# Altium project HBN_Portable_Charger.PrjPcb
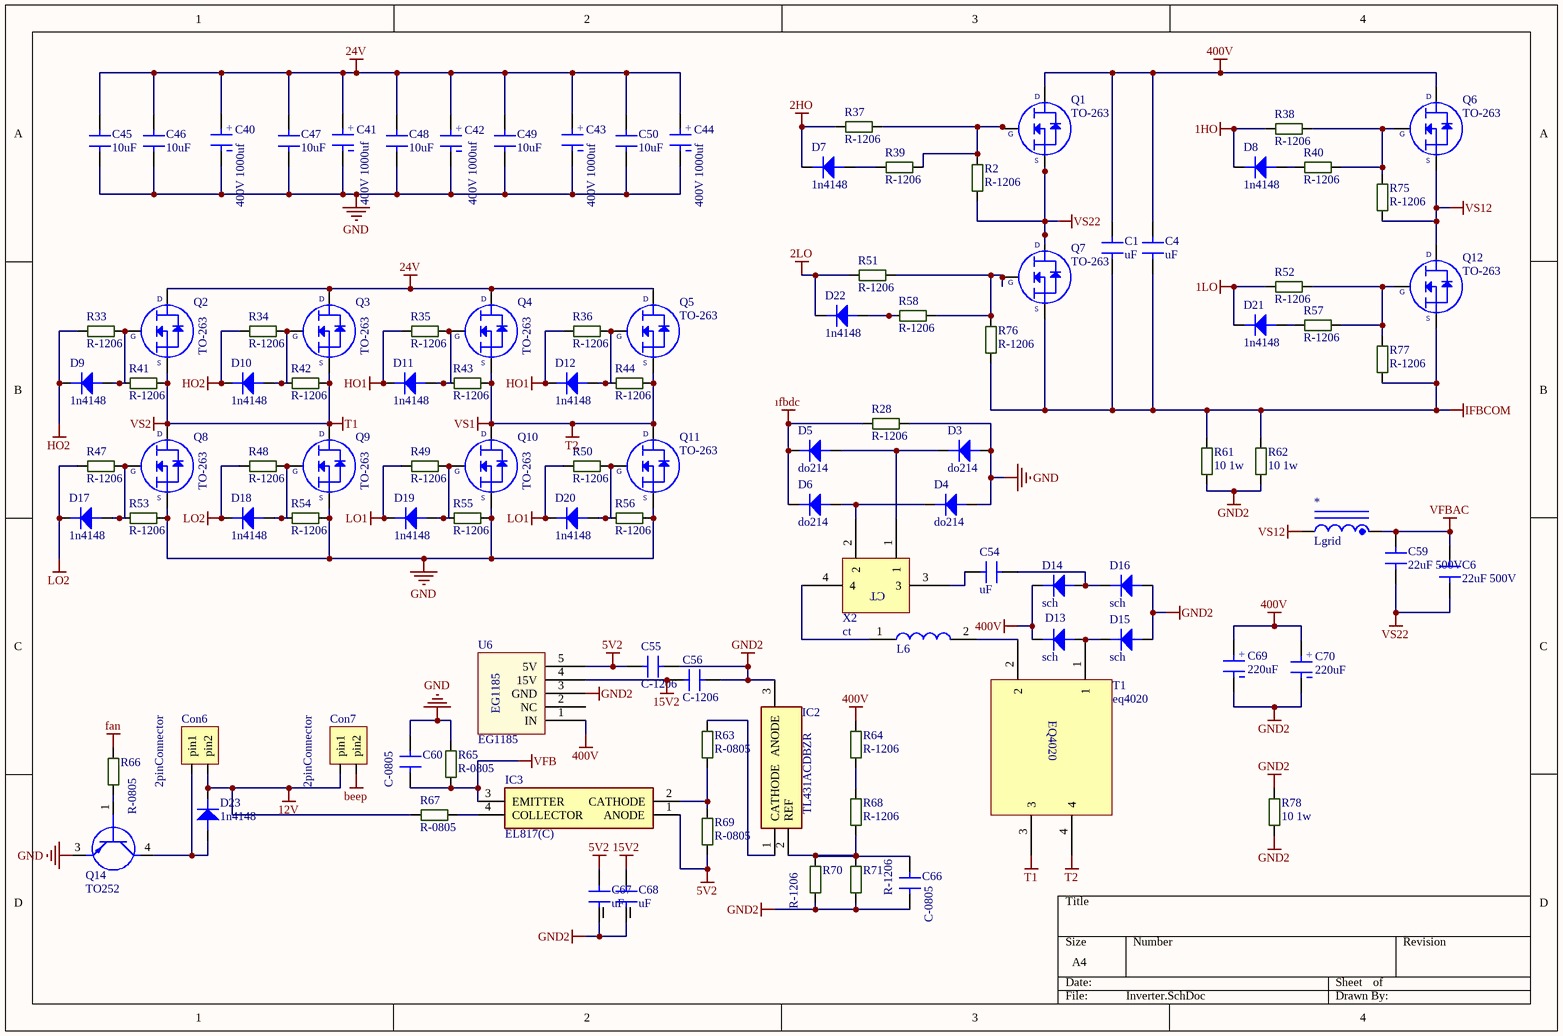
[diagram p0: Inverter.SchDoc]
4 sheets, 213 parts. Net scope: global (net labels, ports and power ports of the same name join across sheets).
Board file: Layout.PcbDoc
Sheets:
  Inverter.SchDoc
  Power Distrubition.SchDoc
  EGT003.SchDoc
  EG8010.SchDoc

## Sheet Inverter.SchDoc
size A4; SheetNumber: 1; SheetTotal: 4

### Parts
*  Lgrid  [Lgrid]
C1  uF  [680nF bulk]
C4  uF  [680nF bulk]
C6  22uF 500V  [CAP.POL 22UF 500VDC - duplicate]
C40  400V 1000uf  [CAP_EEETC1C331V]
C41  400V 1000uf  [CAP_EEETC1C331V]
C42  400V 1000uf  [CAP_EEETC1C331V]
C43  400V 1000uf  [CAP_EEETC1C331V]
C44  400V 1000uf  [CAP_EEETC1C331V]
C45  10uF  [C-2220R]
C46  10uF  [C-2220R]
C47  10uF  [C-2220R]
C48  10uF  [C-2220R]
C49  10uF  [C-2220R]
C50  10uF  [C-2220R]
C54  uF  [680nF bulk]
C55  C-1206  [C-1206W]
C56  C-1206  [C-1206W]
C59  22uF 500V  [CAP.POL 22UF 500VDC - duplicate]
C60  C-0805  [C-0805W]
C66  C-0805  [C-0805W]
C67  uF  [CapSmdElc]
C68  uF  [CapSmdElc]
C69  220uF  [Koshin]
C70  220uF  [Koshin]
Con6  2pinConnector  [2pinCon]
Con7  2pinConnector  [2pinCon]
D3  do214  [DO-214AC]
D4  do214  [DO-214AC]
D5  do214  [DO-214AC]
D6  do214  [DO-214AC]
D7  1n4148  [SOD123]
D8  1n4148  [SOD123]
D9  1n4148  [SOD123]
D10  1n4148  [SOD123]
D11  1n4148  [SOD123]
D12  1n4148  [SOD123]
D13  sch  [DPAK_TO263 - sch]
D14  sch  [DPAK_TO263 - sch]
D15  sch  [DPAK_TO263 - sch]
D16  sch  [DPAK_TO263 - sch]
D17  1n4148  [SOD123]
D18  1n4148  [SOD123]
D19  1n4148  [SOD123]
D20  1n4148  [SOD123]
D21  1n4148  [SOD123]
D22  1n4148  [SOD123]
D23  1n4148  [SOD123]
IC2  TL431ACDBZR  [SOT95P237X112-3N]
IC3  EL817(C)  [DIP762W60P254L458H480Q4N]
L6  inducter_SMPI06050  [inductor]  (value not drawn)
Q1  TO-263  [DPAK_TO263]
Q2  TO-263  [DPAK_TO263]
Q3  TO-263  [DPAK_TO263]
Q4  TO-263  [DPAK_TO263]
Q5  TO-263  [DPAK_TO263]
Q6  TO-263  [DPAK_TO263]
Q7  TO-263  [DPAK_TO263]
Q8  TO-263  [DPAK_TO263]
Q9  TO-263  [DPAK_TO263]
Q10  TO-263  [DPAK_TO263]
Q11  TO-263  [DPAK_TO263]
Q12  TO-263  [DPAK_TO263]
Q14  TO252  [D-PAK_TO252AA]
R2  R-1206  [R-1206W]
R28  R-1206  [R-1206W]
R33  R-1206  [R-1206W]
R34  R-1206  [R-1206W]
R35  R-1206  [R-1206W]
R36  R-1206  [R-1206W]
R37  R-1206  [R-1206W]
R38  R-1206  [R-1206W]
R39  R-1206  [R-1206W]
R40  R-1206  [R-1206W]
R41  R-1206  [R-1206W]
R42  R-1206  [R-1206W]
R43  R-1206  [R-1206W]
R44  R-1206  [R-1206W]
R47  R-1206  [R-1206W]
R48  R-1206  [R-1206W]
R49  R-1206  [R-1206W]
R50  R-1206  [R-1206W]
R51  R-1206  [R-1206W]
R52  R-1206  [R-1206W]
R53  R-1206  [R-1206W]
R54  R-1206  [R-1206W]
R55  R-1206  [R-1206W]
R56  R-1206  [R-1206W]
R57  R-1206  [R-1206W]
R58  R-1206  [R-1206W]
R61  10 1w  [R-2512W]
R62  10 1w  [R-2512W]
R63  R-0805  [R-0805W]
R64  R-1206  [R-1206W]
R65  R-0805  [R-0805W]
R66  R-0805  [R-0805W]
R67  R-0805  [R-0805W]
R68  R-1206  [R-1206W]
R69  R-0805  [R-0805W]
R70  R-1206  [R-1206W]
R71  R-1206  [R-1206W]
R75  R-1206  [R-1206W]
R76  R-1206  [R-1206W]
R77  R-1206  [R-1206W]
R78  10 1w  [R-2512W]
T1  eq4020  [eq4020]
U6  EG1185  [EG1185]
X2  ct  [ct]

### Nets
1HO: D8.k R38.1
1LO: D21.k R52.1
2HO: D7.k R37.1
2LO: D22.k R51.1
5V2: C55.1 C67.1 IC3.1(ANODE) R69.1 U6.5(5V)
12V: Con6.2(pin2) Con7.1(pin1) D23.k R67.1
15V2: C56.1 C68.1 U6.4(15V)
24V: C40.1 C41.1 C42.1 C43.1 C44.1 C45.1 C46.1 C47.1 C48.1 C49.1 C50.1 Q2.3 Q3.3 Q4.3 Q5.3
400V: C1.2 C4.2 C69.2 C70.2 D13.1 D14.1 Q1.3 Q6.3 R64.2 U6.1(IN)
beep: Con7.2(pin2)
fan: R66.1
GND: C40.2 C41.2 C42.2 C43.2 C44.2 C45.2 C46.2 C47.2 C48.2 C49.2 C50.2 C60.2 D3.a D4.a Q8.2 Q9.2 Q10.2 Q11.2 Q14.3(E) R28.2 R53.2 R54.2 R55.2 R56.2 R65.2
GND2: C55.2 C56.2 C66.1 C67.2 C68.2 C69.1 C70.1 D15.2 D16.2 IC2.3(ANODE) R61.1 R62.1 R70.1 R71.1 R78.1 R78.2 U6.3(GND)
HO1: D11.k D12.k R35.1 R36.1
HO2: D9.k D10.k R33.1 R34.1
IFBCOM: C1.1 C4.1 Q7.2 Q12.2 R61.2 R62.2 R76.1 R77.2
LO1: D19.k D20.k R49.1 R50.1
LO2: D17.k D18.k R47.1 R48.1
T1: Q2.2 Q3.2 Q8.3 Q9.3 R41.2 R42.2 T1.3  [also labelled VS2]
T2: Q4.2 Q5.2 Q10.3 Q11.3 R43.2 R44.2 T1.4  [also labelled VS1]
VFB: C60.1 IC3.3(EMITTER) R65.1
VFBAC: *.1 C6.2 C59.2
VS12: *.2 Q6.2 Q12.3 R75.2
VS22: C6.1 C59.1 Q1.2 Q7.3 R2.1
ıfbdc: D5.k D6.k R28.1
NetC54_1: C54.1 X2.3
NetC54_2: C54.2 D14.2 D16.1
NetC66_2: C66.2 IC2.2(REF) R68.1 R70.2 R71.2
NetCon6_1: Con6.1(pin1) D23.a Q14.4(C)
NetD3_k: D3.k D5.a X2.1
NetD4_k: D4.k D6.a X2.2
NetD7_a: D7.a R39.1
NetD8_a: D8.a R40.1
NetD9_a: D9.a Q2.1 R33.2 R41.1
NetD10_a: D10.a Q3.1 R34.2 R42.1
NetD11_a: D11.a Q4.1 R35.2 R43.1
NetD12_a: D12.a Q5.1 R36.2 R44.1
NetD13_2: D13.2 D15.1 T1.1
NetD17_a: D17.a Q8.1 R47.2 R53.1
NetD18_a: D18.a Q9.1 R48.2 R54.1
NetD19_a: D19.a Q10.1 R49.2 R55.1
NetD20_a: D20.a Q11.1 R50.2 R56.1
NetD21_a: D21.a R57.1
NetD22_a: D22.a R58.1
NetIC2_1: IC2.1(CATHODE) R63.1
NetIC3_2: IC3.2(CATHODE) R63.2 R69.2
NetIC3_4: IC3.4(COLLECTOR) R67.2
NetL6_1: L6.1 X2.4
NetL6_2: L6.2 T1.2
NetQ1_1: Q1.1 R2.2 R37.2 R39.2
NetQ6_1: Q6.1 R38.2 R40.2 R75.1
NetQ7_1: Q7.1 R51.2 R58.2 R76.2
NetQ12_1: Q12.1 R52.2 R57.2 R77.1
NetQ14_1: Q14.1(B) R66.2
NetR64_1: R64.1 R68.2

Not connected (* = marked no-connect by the designer): U6 2(NC)

### Notes on the sheet
- (in symbol Aluminum Electrolytic Capacitors) +
- (in symbol CAP.EL.220uF 500V) +
- (in symbol ct) CT
- (in symbol eq4020) EQ4020
- (in symbol TO-263_1) D; G; S

### Library data of the parts
C1 C4 C54 = 680
C6 C59 = CAP.POL 22UF 500VDC: ComponentLink1Description: https://www.ozdisan.com/pasif-komponentler/kondansatorler/film-kondansatorler/C3D2H226JB00C00; ComponentLink1URL: https://www.ozdisan.com/pasif-komponentler/kondansatorler/film-kondansatorler/C3D2H226JB00C00
C40-C44 = Aluminum Electrolytic Capacitors: Manufacturer: Nichicon; Manufacturer Part Number: LKS1J472MESZ; Capacitance: 4.7mF; Voltage Rating: 63V; Tolerance: 20%; Ripple Current: 3A; Life (Hours): 1000Hour; Supplier 1: Mouser; RoHS: Yes; Mount: Through Hole; Case/Package: Radial; Min Operating Temperature: -40°C; Max Operating Temperature: 85°C; Package Quantity: 250; Packaging: Bulk; Voltage Rating (DC): 63V; Termination: Snap in; Diameter: 22mm; Length: 45mm; Lead Pitch: 0.394inch; Height - Seated (Max): 1.772inch; Supplier Part Number 1: 647-LKS1J472MESZ; ComponentLink2Description: https://www.ozdisan.com/pasif-komponentler/kondansatorler/aluminyum-kondansatorler/PKL5-063V472MM450; ComponentLink2URL: https://www.ozdisan.com/pasif-komponentler/kondansatorler/aluminyum-kondansatorler/PKL5-063V472MM450
C45-C50 = Cap2220: 2220; Özdisan Part Number: CL31B475KBHNNNE; Manufacturer: SAMSUNG; Link: https://www.ozdisan.com/pasif-komponentler/kondansatorler/smd-kondansatorler-mlcc/CL31B475KBHNNNE; Price: 0,10407
C67 C68 = CAPSMDELC
C69 C70 = CAP.EL.220uF 500V: ComponentLink1Description: https://www.ozdisan.com/pasif-komponentler/kondansatorler/aluminyum-kondansatorler/K055002210PM0E040; ComponentLink1URL: https://www.ozdisan.com/pasif-komponentler/kondansatorler/aluminyum-kondansatorler/K055002210PM0E040
D3-D6 = do214: DIODE FAST SWITCHING Single 150mA 75V SMT SOD323
D7-D12 D17-D23 = 1N4148W-E3-18: Diode Small Signal Switching 100V 0.15A 2-Pin SOD-123 T/R; Manufacturer: Vishay; Recovery Time: 4ns; Max Power Dissipation: 350mW; Forward Current: 150mA; Max Surge Current: 2A; Forward Voltage: 1.2V; Max Reverse Leakage Current: 5uA; Element Configuration: Single; Max Reverse Voltage (DC): 75V; Peak Reverse Current: 100uA; Supplier 1: Allied Electronics; Manufacturer Part Number: 1N4148W-E3-18; RoHS: Yes; Stock 1: 6838; Pricing 1: 1 = 0.03900, 25 = 0.03800, 100 = 0.03600, 250 = 0.03400, 500 = 0.03200, 1000 = 0.03100, 2500 = 0.02900 (USD); Mount: Surface Mount; Number of Pins: 2; Weight: 0.000363oz; Contact Plating: Tin; Min Operating Temperature: -55°C; Max Operating Temperature: 150°C; Packaging: Tape and Reel; Package Quantity: 10000; Average Rectified Current: 150mA; Reverse Recovery Time: 4ns; Power Dissipation: 350mW; Max Repetitive Reverse Voltage (Vrrm): 100V; Peak Non-Repetitive Surge Current: 2A; Length: 2.85mm; Height: 1.25mm; Width: 1.7mm; Radiation Hardening: No; Lead Free: Lead Free; ComponentLink1URL: https://datasheet.ciiva.com/29885/1n4148w-29885941.pdf?src-supplier=Avnet; ComponentLink1Description: https://datasheet.ciiva.com/29885/1n4148w-29885941.pdf?src-supplier=Avnet; ComponentLink2URL: https://datasheet.ciiva.com/29593/1n4148w-29593113.pdf?src-supplier=Digi-Key; ComponentLink2Description: https://datasheet.ciiva.com/29593/1n4148w-29593113.pdf?src-supplier=Digi-Key; ComponentLink3URL: https://datasheet.ciiva.com/29593/1n4148w-29593111.pdf?src-supplier=Digi-Key; ComponentLink3Description: https://datasheet.ciiva.com/29593/1n4148w-29593111.pdf?src-supplier=Digi-Key; ComponentLink4URL: https://datasheet.ciiva.com/29593/1n4148w-29593112.pdf?src-supplier=Digi-Key; ComponentLink4Description: https://datasheet.ciiva.com/29593/1n4148w-29593112.pdf?src-supplier=Digi-Key; Supplier Part Number 1: 70061597
D13-D16 = sch: DIODE FAST SWITCHING Single 150mA 75V SMT SOD323
IC2 = TL431ACDBZR: Integrated Circuit; Manufacturer_Name: Texas Instruments; Datasheet Link: https://datasheet.datasheetarchive.com/originals/distributors/SFDatasheet-6/sf-000131849.pdf; Manufacturer_Part_Number: TL431ACDBZR; Mouser Part Number: 595-TL431ACDBZR; Mouser Price/Stock: https://www.mouser.co.uk/ProductDetail/Texas-Instruments/TL431ACDBZR?qs=odmYgEirbwzMcBuFx%2Fo8hQ%3D%3D; Arrow Part Number: TL431ACDBZR; Arrow Price/Stock: https://www.arrow.com/en/products/tl431acdbzr/texas-instruments?region=nac
IC3 = EL817(C): Integrated Circuit; Manufacturer_Name: Everlight; Datasheet Link: https://componentsearchengine.com/Datasheets/1/EL817(C).pdf; Height: 4.8mm; Manufacturer_Part_Number: EL817(C); Mouser Part Number: 638-EL817C; Mouser Price/Stock: https://www.mouser.com/Search/Refine.aspx?Keyword=638-EL817C
Q1-Q12 = TO-263_1
R61 R62 R78 = R-2512

## Sheet Power Distrubition.SchDoc
size A4; SheetNumber: 2; SheetTotal: 4
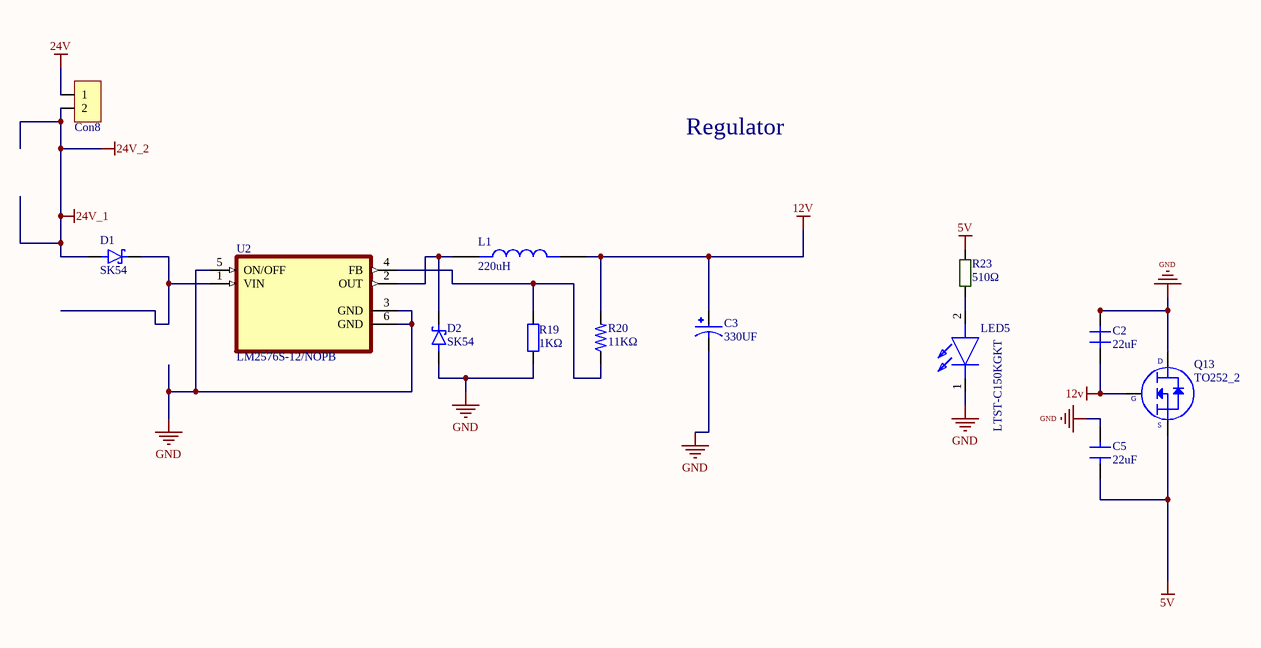
[diagram p1: Power Distrubition.SchDoc]

### Parts
C2  22uF  [C-0805]
C3  330UF  [CAP_EEETC1C331V]
C5  22uF  [C-0805]
Con8  Connector2_1  [Conn]  (value not drawn)
D1  SK54  [DIOM7959X265N]
D2  SK54  [DIOM7959X265N]
L1  220uH  [IND_MDH12577C-101MA=P3]
LED5  LTST-C150KGKT  [LED1206]
Q13  TO252_2  [TO-252]
R19  Deger: 1KΩ  [R-0805]  (hidden comment: RES SMD 1K OHM 1% 1/8W 0805)
R20  11KΩ  [R-0805]
R23  510Ω  [R-0603R]
U2  LM2576S-12/NOPB  [VREG_TPS79625KTTR]

### Nets
5V: C5.1 Q13.3 R23.2
12V: C2.1 C3.1 L1.2 Q13.1 R20.2
24V: Con8.1
24V_1: Con8.2 D1.A  [also labelled 24V_2]
GND: C2.2 C3.2 C5.2 D2.A LED5.1(K) Q13.4 R19.1 U2.3(GND) U2.5(ON/OFF) U2.6(GND)
NetD1_C: D1.C(K) U2.1(VIN)
NetD2_C: D2.C(K) L1.1 U2.2(OUT)
NetLED5_2: LED5.2(A) R23.1
NetR19_2: R19.2 R20.1 U2.4(FB)

### Notes on the sheet
- Regulator
- (in symbol TO252_2) D; G; S

### Library data of the parts
C2 C5 = C-0805
C3 = CAP 330UF SMD: CAP ALUM 330UF 20% 16V SMD; MP: EEE-TC1C331V; MF: Panasonic Electronic Components; Value: *; Package: RADIAL-2 Panasonic; Availability: In Stock; SnapEDA_Link: https://www.snapeda.com/parts/EEE-TC1C331V/Panasonic/view-part/6178283/?ref=snap; Price: None; Purchase-URL: https://pricing.snapeda.com/search/part/EEE-TC1C331V/?ref=eda; Check_prices: https://www.snapeda.com/parts/EEE-TC1C331V/Panasonic/view-part/6178283/?ref=eda
D1 D2 = SK54: Diode Schottky 40V 5A Surface Mount DO-214AA (SMB); MP: MBRS320T3G; MF: ON Semiconductor; Package: DO-214 ON Semiconductor; Availability: Good; Arrow_Electronics-Purchase-URL: https://snapeda.com/shop?store=Arrow+Electronics&id=432205; SnapEDA_Link: https://www.snapeda.com/parts/MBRS320T3G/ON%20Semiconductor/view-part/432205/?ref=snap; DigiKey-Purchase-URL: https://snapeda.com/shop?store=DigiKey&id=432205; Mouser-Purchase-URL: https://snapeda.com/shop?store=Mouser&id=432205; Value: *; Price: None
L1 = 220uH Inductor SMD: Inductor Power Shielded Wirewound 220uH 20% 100KHz Ferrite 1.1A 0.325Ohm DCR 5049 Automotive T/R; MP: MDH12577C-101MA=P3; Package: None; Price: None; Value: *; Availability: Unavailable
LED5 = LTST-C150KGKT: LED; Manufacturer_Name: Lite-On; Datasheet Link: http://optoelectronics.liteon.com/upload/download/ds22-2000-072/ltst-c150kgkt.pdf; Height: 1.2mm; Manufacturer_Part_Number: LTST-C150KGKT; Mouser Part Number: 859-LTST-C150KGKT; Mouser Price/Stock: https://www.mouser.com/Search/Refine.aspx?Keyword=859-LTST-C150KGKT; RS Part Number: 6920871; RS Price/Stock: https://uk.rs-online.com/web/p/products/6920871
Q13 = TO252_2: Manufacturer: Infineon; Manufacturer Part Number: IRF3205STRLPBF; Drain to Source Voltage (Vdss): 55V; Continuous Drain Current (ID): 110A; Rds On Max: 8mR; Input Capacitance: 3.247nF; Max Power Dissipation: 200W; Turn-Off Delay Time: 50ns; Turn-On Delay Time: 14ns; Gate to Source Voltage (Vgs): 20V; Threshold Voltage: 4V; Supplier 1: Digi-Key; RoHS: Yes; Stock 1: 3281; Pricing 1: 1 = 1,84000, 10 = 1,66600, 100 = 1,33840 (USD); Mount: Surface Mount; Case/Package: D2PAK; Number of Pins: 3; Min Operating Temperature: -55°C; Max Operating Temperature: 175°C; Packaging: Cut Tape; Power Dissipation: 200W; Drain to Source Resistance: 8mR; Drain to Source Breakdown Voltage: 55V; Length: 0.42inch; Height: 0.19inch; Width: 0.38inch; REACH SVHC: No SVHC; Lead Free: Lead Free; ComponentLink1URL: https://www.alliedelec.com/m/d/b8827ca43655240244f0cc5c2198e6b1.pdf?src-supplier=Allied+Electronics; ComponentLink1Description: https://www.alliedelec.com/m/d/b8827ca43655240244f0cc5c2198e6b1.pdf?src-supplier=Allied+Electronics; ComponentLink2URL: https://www.infineon.com/dgdl/irf3205spbf.pdf?fileId=5546d462533600a4015355defac9190c&src-supplier=Digi-Key; ComponentLink2Description: https://www.infineon.com/dgdl/irf3205spbf.pdf?fileId=5546d462533600a4015355defac9190c&src-supplier=Digi-Key; ComponentLink3URL: http://www.infineon.com/dgdl/irf3205spbf.pdf?fileId=5546d462533600a4015355defac9190c&src-supplier=Digi-Key; ComponentLink3Description: http://www.infineon.com/dgdl/irf3205spbf.pdf?fileId=5546d462533600a4015355defac9190c&src-supplier=Digi-Key; ComponentLink4URL: http://www.farnell.com/datasheets/1884183.pdf?src-supplier=Element14; ComponentLink4Description: http://www.farnell.com/datasheets/1884183.pdf?src-supplier=Element14; Supplier Part Number 1: IRF3205STRLPBFCT-ND
R19 = 1K 0805: 1 kOhms ±1% 0.125W, 1/8W Chip Resistor 0805 (2012 Metric) Moisture Resistant Thick Film; Cins: Direnc; Uretici Kodu: RC0805FR-071KL; Kılıf: 0805; -Sicaklik: -55; +Sicaklik: +155; Lehim Yöntemi: SMD; MSL: 1 (Unlimited)
R20 = RES 11KΩ SMD: THICK FILM RESISTOR, 11KOHM, 125mW, 5%; MP: CRCW080511K0JNEA; Package: None; Price: None; Value: *; Availability: Unavailable
R23 = R-0603
U2 = LM2576S-12/NOPB: SIMPLE SWITCHER&reg; 40V, 3A Low Component Count Step-Down Regulator 5-DDPAK/TO-263 -40 to 125; MF: Texas Instruments; Availability: Warning; SnapEDA_Link: https://www.snapeda.com/parts/LM2576S-12/NOPB/Texas%20Instruments/view-part/470772/?ref=snap; Mouser-Purchase-URL: https://snapeda.com/shop?store=Mouser&id=470772; Texas_Instruments-Purchase-URL: https://snapeda.com/shop?store=Texas+Instruments&id=470772; Value: *; Price: None; Package: TO-263-5 Texas Instruments; DigiKey-Purchase-URL: https://snapeda.com/shop?store=DigiKey&id=470772; MP: LM2576S-12/NOPB; BuyPart: https://www.snapeda.com/parts/LM2576S-12/NOPB/Texas%20Instruments/view-part/470772/?ref=eda
Con8 = Connector2_1: System: Connector

## Sheet EGT003.SchDoc
size A4; SheetNumber: 3; SheetTotal: 4
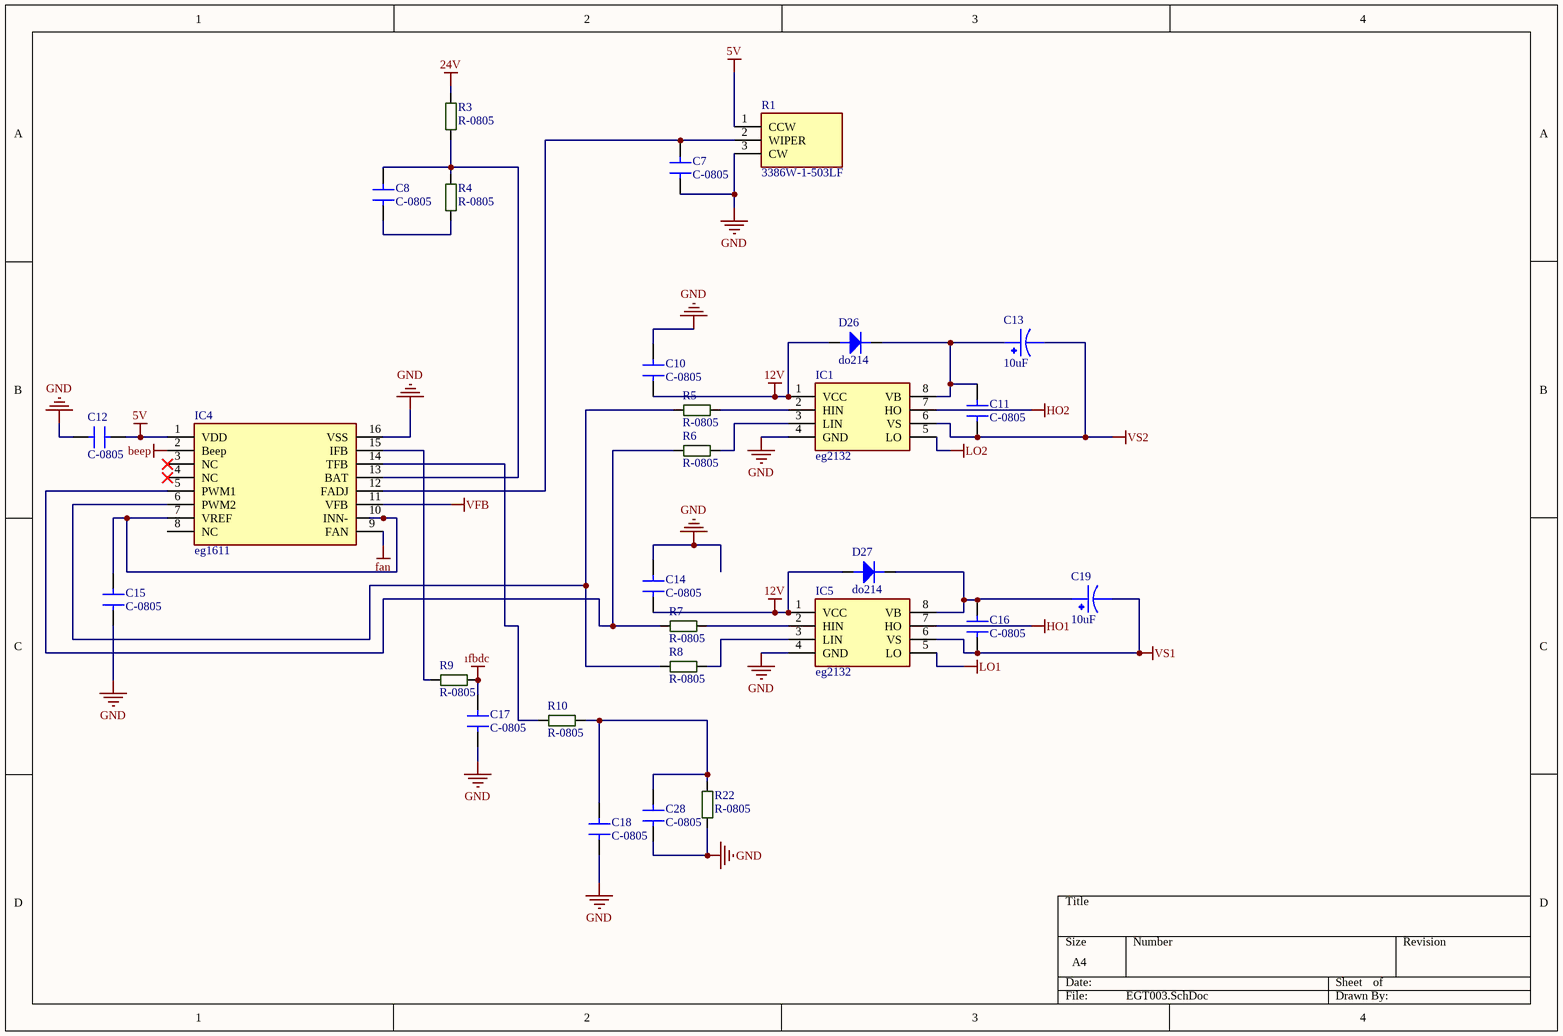
[diagram p2: EGT003.SchDoc]

### Parts
C7  C-0805  [C-0805W]
C8  C-0805  [C-0805W]
C10  C-0805  [C-0805W]
C11  C-0805  [C-0805W]
C12  C-0805  [C-0805W]
C13  10uF  [CapSmdElc]
C14  C-0805  [C-0805W]
C15  C-0805  [C-0805W]
C16  C-0805  [C-0805W]
C17  C-0805  [C-0805W]
C18  C-0805  [C-0805W]
C19  10uF  [CapSmdElc]
C28  C-0805  [C-0805W]
D26  do214  [DO-214AC]
D27  do214  [DO-214AC]
IC1  eg2132  [SOIC127P600X175-8N]
IC4  eg1611  [SOIC127P600X175-16N]
IC5  eg2132  [SOIC127P600X175-8N]
R1  3386W-1-503LF  [3386W]
R3  R-0805  [R-0805W]
R4  R-0805  [R-0805W]
R5  R-0805  [R-0805W]
R6  R-0805  [R-0805W]
R7  R-0805  [R-0805W]
R8  R-0805  [R-0805W]
R9  R-0805  [R-0805W]
R10  R-0805  [R-0805W]
R22  R-0805  [R-0805W]

### Nets
5V: C12.2 IC4.1(VDD) R1.1(CCW)
12V: C10.1 C14.1 D26.a D27.a IC1.1(VCC) IC5.1(VCC)
24V: R3.2
beep: IC4.2(Beep)
fan: IC4.9(FAN)
GND: C7.1 C10.2 C12.1 C14.2 C15.1 C17.1 C18.1 C28.1 IC1.4(GND) IC4.16(VSS) IC5.4(GND) R1.3(CW) R22.1
HO1: IC5.7(HO)
HO2: IC1.7(HO)
LO1: IC5.5(LO)
LO2: IC1.5(LO)
VFB: IC4.11(VFB)
VS1: C16.1 C19.2 IC5.6(VS)  [project net T2]
VS2: C11.1 C13.2 IC1.6(VS)  [project net T1]
ıfbdc: C17.2 R9.1
NetC7_2: C7.2 IC4.12(FADJ) R1.2(WIPER)
NetC8_1: C8.1 R4.1
NetC8_2: C8.2 IC4.13(BAT) R3.1 R4.2
NetC11_2: C11.2 C13.1 D26.k IC1.8(VB)
NetC15_2: C15.2 IC4.7(VREF) IC4.10(INN-)
NetC16_2: C16.2 C19.1 D27.k IC5.8(VB)
NetC18_2: C18.2 C28.2 R10.1 R22.2
NetIC1_2: IC1.2(HIN) R5.1
NetIC1_3: IC1.3(LIN) R6.1
NetIC4_5: IC4.5(PWM1) R6.2 R7.2
NetIC4_6: IC4.6(PWM2) R5.2 R8.2
NetIC4_14: IC4.14(TFB) R10.2
NetIC4_15: IC4.15(IFB) R9.2
NetIC5_2: IC5.2(HIN) R7.1
NetIC5_3: IC5.3(LIN) R8.1

Not connected (* = marked no-connect by the designer): IC4 3(NC)* 4(NC)* 8(NC)

### Library data of the parts
C13 C19 = 100 uF Electr Cap
D26 D27 = do214: as D3 on sheet Inverter
IC1 IC5 = eg2132: Integrated Circuit; Manufacturer_Name: Texas Instruments; Manufacturer_Part_Number: LM393ADR; Datasheet Link: http://www.ti.com/lit/ds/symlink/lm393a.pdf; Height: 1.75mm; Mouser Part Number: 595-LM393ADR; Mouser Price/Stock: https://www.mouser.co.uk/ProductDetail/Texas-Instruments/LM393ADR?qs=VolsR0DjNPq76ZV6Dhd8nQ%3D%3D; Arrow Part Number: LM393ADR; Arrow Price/Stock: https://www.arrow.com/en/products/lm393adr/texas-instruments
IC4 = eg1611: Integrated Circuit; Manufacturer_Name: STMicroelectronics; Manufacturer_Part_Number: HCF4538M013TR; Datasheet Link: http://www.st.com/resource/en/datasheet/cd00000410.pdf; Height: 1.75mm; Mouser Part Number: 511-4538BM-TR; Mouser Price/Stock: https://www.mouser.com/Search/Refine.aspx?Keyword=511-4538BM-TR
R1 = 3386W-1-503LF: Resistor; Manufacturer_Name: Bourns; Datasheet Link: http://www.bourns.com/docs/Product-Datasheets/3386.pdf; Manufacturer_Part_Number: 3386W-1-503LF; Mouser Part Number: 652-3386W-1-503LF; Mouser Price/Stock: https://www.mouser.co.uk/ProductDetail/Bourns/3386W-1-503LF?qs=aZhnFHiXcUS20GqScAFfrw%3D%3D; Arrow Part Number: 3386W-1-503LF; Arrow Price/Stock: https://www.arrow.com/en/products/3386w-1-503lf/bourns

## Sheet EG8010.SchDoc
size A4; SheetNumber: 4; SheetTotal: 4
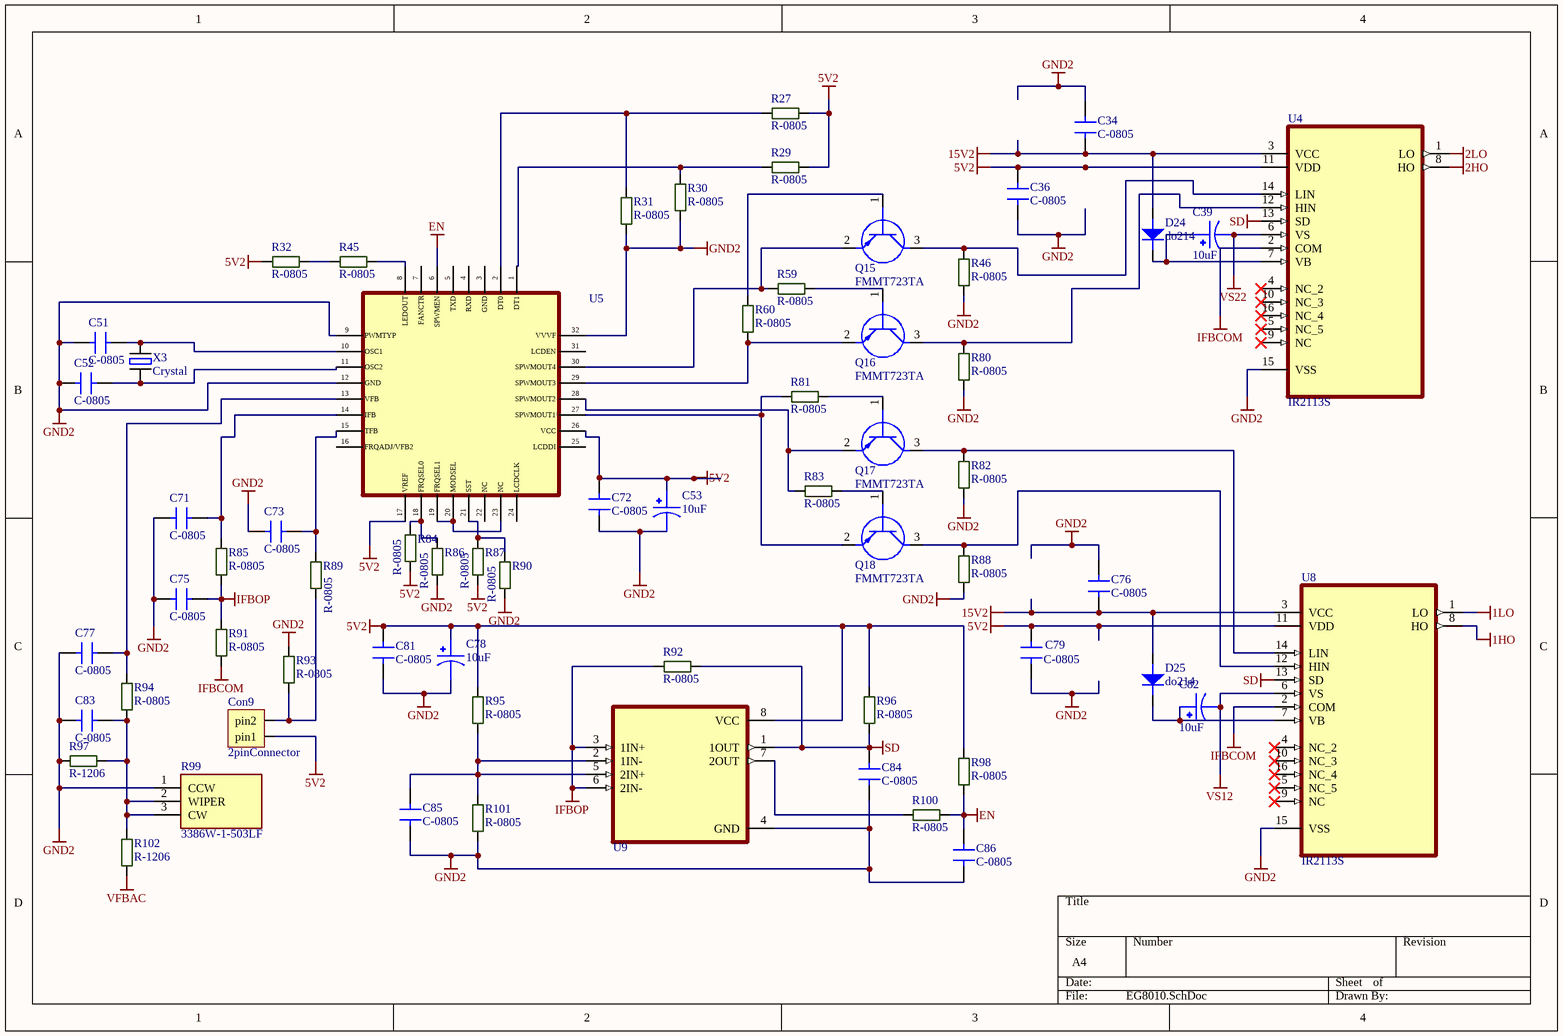
[diagram p3: EG8010.SchDoc]

### Parts
C34  C-0805  [C-0805W]
C36  C-0805  [C-0805W]
C39  10uF  [CapSmdElc]
C51  C-0805  [C-0805W]
C52  C-0805  [C-0805W]
C53  10uF  [CapSmdElc]
C71  C-0805  [C-0805W]
C72  C-0805  [C-0805W]
C73  C-0805  [C-0805W]
C75  C-0805  [C-0805W]
C76  C-0805  [C-0805W]
C77  C-0805  [C-0805W]
C78  10uF  [CapSmdElc]
C79  C-0805  [C-0805W]
C81  C-0805  [C-0805W]
C82  10uF  [CapSmdElc]
C83  C-0805  [C-0805W]
C84  C-0805  [C-0805W]
C85  C-0805  [C-0805W]
C86  C-0805  [C-0805W]
Con9  2pinConnector  [2pinCon]
D24  do214  [DO-214AC]
D25  do214  [DO-214AC]
Q15  FMMT723TA  [SOT96P240X100-3N]
Q16  FMMT723TA  [SOT96P240X100-3N]
Q17  FMMT723TA  [SOT96P240X100-3N]
Q18  FMMT723TA  [SOT96P240X100-3N]
R27  R-0805  [R-0805W]
R29  R-0805  [R-0805W]
R30  R-0805  [R-0805W]
R31  R-0805  [R-0805W]
R32  R-0805  [R-0805W]
R45  R-0805  [R-0805W]
R46  R-0805  [R-0805W]
R59  R-0805  [R-0805W]
R60  R-0805  [R-0805W]
R80  R-0805  [R-0805W]
R81  R-0805  [R-0805W]
R82  R-0805  [R-0805W]
R83  R-0805  [R-0805W]
R84  R-0805  [R-0805W]
R85  R-0805  [R-0805W]
R86  R-0805  [R-0805W]
R87  R-0805  [R-0805W]
R88  R-0805  [R-0805W]
R89  R-0805  [R-0805W]
R90  R-0805  [R-0805W]
R91  R-0805  [R-0805W]
R92  R-0805  [R-0805W]
R93  R-0805  [R-0805W]
R94  R-0805  [R-0805W]
R95  R-0805  [R-0805W]
R96  R-0805  [R-0805W]
R97  R-1206  [R-1206W]
R98  R-0805  [R-0805W]
R99  3386W-1-503LF  [3386W]
R100  R-0805  [R-0805W]
R101  R-0805  [R-0805W]
R102  R-1206  [R-1206W]
U4  IR2113S  [SOIC127P1032X265-16N]
U5  EG8010  [EG8010]  (value not drawn)
U8  IR2113S  [SOIC127P1032X265-16N]
U9  LM393D  [SOIC127P600X175-8N]  (value not drawn)
X3  Crystal  [crystal]

### Nets
1HO: U8.8(HO)
1LO: U8.1(LO)
2HO: U4.8(HO)
2LO: U4.1(LO)
5V2: C36.2 C53.1 C72.2 C78.1 C79.2 C81.2 Con9.1(pin1) R27.2 R29.2 R32.1 R84.1 R87.1 R95.2 R96.2 R98.1 U4.11(VDD) U5.17(VREF) U5.26(VCC) U8.11(VDD) U9.8(VCC)
15V2: C34.2 C76.2 D24.a D25.a U4.3(VCC) U8.3(VCC)
EN: C86.2 R98.2 R100.1 U5.6(SPWMEN)
GND2: C34.1 C36.1 C51.1 C52.1 C53.2 C71.1 C72.1 C73.1 C75.1 C76.1 C77.1 C78.2 C79.1 C81.1 C83.1 C84.1 C85.1 C86.1 R30.1 R31.1 R46.2 R80.2 R82.2 R86.1 R88.2 R90.1 R93.2 R97.2 R99.1(CCW) R101.1 U4.15(VSS) U5.9(PWMTYP) U5.12(GND) U5.32(VVVF) U8.15(VSS) U9.4(GND)
IFBCOM: R91.1 U4.2(COM) U8.2(COM)
IFBOP: C75.2 R85.1 R91.2 R92.1 U9.3(1IN+) U9.6(2IN-)
SD: C84.2 R92.2 R96.1 U4.13(SD) U8.13(SD) U9.1(1OUT)
VFBAC: R102.1
VS12: C82.2 U8.6(VS)
VS22: C39.2 U4.6(VS)
NetC39_1: C39.1 D24.k U4.7(VB)
NetC51_2: C51.2 U5.10(OSC1) X3.1
NetC52_2: C52.2 U5.11(OSC2) X3.2
NetC71_2: C71.2 R85.2 U5.14(IFB)
NetC73_2: C73.2 R89.2 U5.15(TFB)
NetC77_2: C77.2 R94.2 U5.13(VFB)
NetC82_1: C82.1 D25.k U8.7(VB)
NetC83_2: C83.2 R94.1 R97.1 R99.2(WIPER) R99.3(CW) R102.2
NetC85_2: C85.2 R95.1 R101.2 U9.2(1IN-) U9.5(2IN+)
NetCon9_2: Con9.2(pin2) R89.1 R93.1
NetQ15_1: Q15.1(B) R60.2
NetQ15_2: Q15.2(E) R59.2 U5.30(SPWMOUT4)
NetQ15_3: Q15.3(C) R46.1 U4.14(LIN)
NetQ16_1: Q16.1(B) R59.1
NetQ16_2: Q16.2(E) R60.1 U5.29(SPWMOUT3)
NetQ16_3: Q16.3(C) R80.1 U4.12(HIN)
NetQ17_1: Q17.1(B) R81.1
NetQ17_2: Q17.2(E) R83.2 U5.28(SPWMOUT2)
NetQ17_3: Q17.3(C) R82.1 U8.14(LIN)
NetQ18_1: Q18.1(B) R83.1
NetQ18_2: Q18.2(E) R81.2 U5.27(SPWMOUT1)
NetQ18_3: Q18.3(C) R88.1 U8.12(HIN)
NetR27_1: R27.1 R31.2 U5.2(DT0)
NetR29_1: R29.1 R30.2 U5.1(DT1)
NetR32_2: R32.2 R45.1
NetR45_2: R45.2 U5.8(LEDOUT)
NetR84_2: R84.2 R86.2 U5.18(FRQSEL0)
NetR87_2: R87.2 R90.2 U5.21(SST)
NetR100_2: R100.2 U9.7(2OUT)
NetU5_19: U5.19(FRQSEL1) U5.20(MODSEL) U5.23(NC)

Not connected (* = marked no-connect by the designer): U4 4(NC_2)* 5(NC_5)* 9(NC)* 10(NC_3)* 16(NC_4)*; U5 3(GND) 4(RXD) 5(TXD) 7(FANCTR) 16(FRQADJ/VFB2) 22(NC) 24(LCDCLK) 25(LCDDI) 31(LCDEN); U8 4(NC_2)* 5(NC_5)* 9(NC)* 10(NC_3)* 16(NC_4)*

### Library data of the parts
C39 C53 C78 C82 = 100 uF Electr Cap
D24 D25 = do214: as D3 on sheet Inverter
Q15-Q18 = FMMT723TA: Transistor BJT PNP; Manufacturer_Name: Diodes Inc.; Datasheet Link: https://componentsearchengine.com/Datasheets/2/FMMT723TA.pdf; Height: 1mm; Manufacturer_Part_Number: FMMT723TA; Mouser Part Number: 522-FMMT723TA; Mouser Price/Stock: https://www.mouser.co.uk/ProductDetail/Diodes-Incorporated/FMMT723TA?qs=MQZxQ7B7MZKu7Wrs0zY3fA%3D%3D; Arrow Part Number: FMMT723TA; Arrow Price/Stock: https://www.arrow.com/en/products/fmmt723ta/diodes-incorporated
R99 = 3386W-1-503LF: Resistor; Manufacturer_Name: Bourns; Datasheet Link: http://www.bourns.com/docs/Product-Datasheets/3386.pdf; Manufacturer_Part_Number: 3386W-1-503LF; Mouser Part Number: 652-3386W-1-503LF; Mouser Price/Stock: https://www.mouser.co.uk/ProductDetail/Bourns/3386W-1-503LF?qs=aZhnFHiXcUS20GqScAFfrw%3D%3D; Arrow Part Number: 3386W-1-503LF; Arrow Price/Stock: https://www.arrow.com/en/products/3386w-1-503lf/bourns
U4 U8 = IR2113S: Half-Bridge Gate Driver IC Non-Inverting 16-SOIC; MF: Infineon Technologies; Value: *; SnapEDA_Link: https://www.snapeda.com/parts/IR2113S/Infineon%20Technologies/view-part/577803/?ref=snap; Package: SOIC-16 Infineon; MP: IR2113S; Availability: Unavailable; Price: None
U5 = EG8010: EG8010 is a CMOS IC that integrates SPWM sinusoid generator, dead / time control circuit, range divider，soft start circuit, circuit protection, RS232 serial communication, / 12832 serial LCD unit, and etc.
U9 = LM393D: Dual differential comparator, commercial grade 8-SOIC 0 to 70; MF: Texas Instruments; SnapEDA_Link: https://www.snapeda.com/parts/LM393D/Texas%20Instruments/view-part/4806035/?ref=snap; Package: SOIC-8 Texas Instruments; Availability: Good; Value: *; MP: LM393D; Mouser-Purchase-URL: https://snapeda.com/shop?store=Mouser&id=4806035; Arrow_Electronics-Purchase-URL: https://snapeda.com/shop?store=Arrow+Electronics&id=4806035; Price: None; Texas_Instruments-Purchase-URL: https://snapeda.com/shop?store=Texas+Instruments&id=4806035; BuyPart: https://www.snapeda.com/parts/LM393D/Texas%20Instruments/view-part/4806035/?ref=eda
X3 = Crystal: AS49SD-16M-FC160F3-TR

## Nets that join several sheets
1HO: Inverter (D8.k R38.1), EG8010 (U8.8)
1LO: Inverter (D21.k R52.1), EG8010 (U8.1)
2HO: Inverter (D7.k R37.1), EG8010 (U4.8)
2LO: Inverter (D22.k R51.1), EG8010 (U4.1)
5V: Power Distrubition (C5.1 Q13.3 R23.2), EGT003 (C12.2 IC4.1 R1.1)
5V2: Inverter (5 pins), EG8010 (20 pins)
12V: Inverter (Con6.2 Con7.1 D23.k R67.1), Power Distrubition (5 pins), EGT003 (6 pins)
15V2: Inverter (C56.1 C68.1 U6.4), EG8010 (6 pins)
24V: Inverter (15 pins), Power Distrubition (Con8.1), EGT003 (R3.2)
beep: Inverter (Con7.2), EGT003 (IC4.2)
fan: Inverter (R66.1), EGT003 (IC4.9)
GND: Inverter (25 pins), Power Distrubition (10 pins), EGT003 (13 pins)
GND2: Inverter (17 pins), EG8010 (36 pins)
HO1: Inverter (D11.k D12.k R35.1 R36.1), EGT003 (IC5.7)
HO2: Inverter (D9.k D10.k R33.1 R34.1), EGT003 (IC1.7)
IFBCOM: Inverter (8 pins), EG8010 (R91.1 U4.2 U8.2)
LO1: Inverter (D19.k D20.k R49.1 R50.1), EGT003 (IC5.5)
LO2: Inverter (D17.k D18.k R47.1 R48.1), EGT003 (IC1.5)
T1: Inverter (7 pins), EGT003 (C11.1 C13.2 IC1.6)
T2: Inverter (7 pins), EGT003 (C16.1 C19.2 IC5.6)
VFB: Inverter (C60.1 IC3.3 R65.1), EGT003 (IC4.11)
VFBAC: Inverter (*.1 C6.2 C59.2), EG8010 (R102.1)
VS12: Inverter (*.2 Q6.2 Q12.3 R75.2), EG8010 (C82.2 U8.6)
VS22: Inverter (5 pins), EG8010 (C39.2 U4.6)
ıfbdc: Inverter (D5.k D6.k R28.1), EGT003 (C17.2 R9.1)